# Altium schematic sheet Power.SchDoc
size A4; SheetNumber: 6; SheetTotal: 6
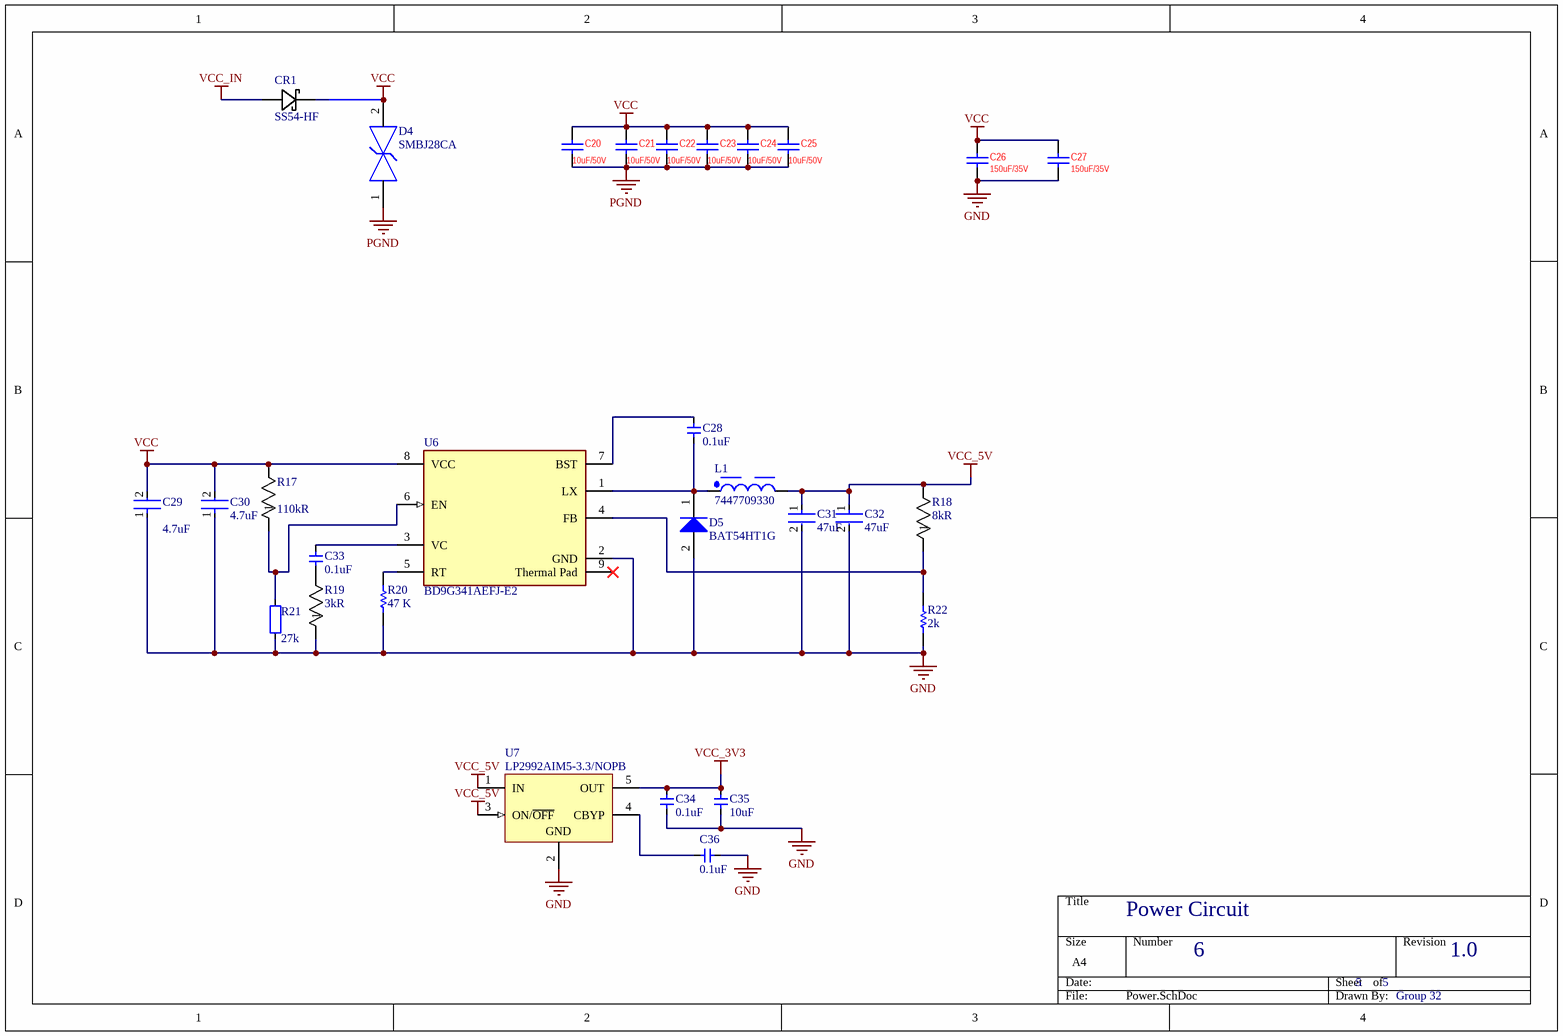
[diagram p0: Power.SchDoc]

## Parts
C20  10uF/50V  [CAPC3216X190N]
C21  10uF/50V  [CAPC3216X190N]
C22  10uF/50V  [CAPC3216X190N]
C23  10uF/50V  [CAPC3216X190N]
C24  10uF/50V  [CAPC3216X190N]
C25  10uF/50V  [CAPC3216X190N]
C26  value 150uF/35V  [CAP_EEEFK1V151AL]  (hidden comment: 220uF/25V)
C27  value 150uF/35V  [CAP_EEEFK1V151AL]  (hidden comment: 220uF/25V)
C28  0.1uF  [CAPC2013X94X50LL20T25]
C29  Capacitance: 4.7uF  [FP-1206-L_3_2_0_2-W_1_6_0-MFG]  (hidden comment: 12061Z475KAT2A)
C30  Capacitance: 4.7uF  [FP-1206-L_3_2_0_2-W_1_6_0-MFG]  (hidden comment: 12061Z475KAT2A)
C31  Capacitance: 47uF  [FP-C3216-160-0_2-IPC_C]  (hidden comment: C3216X6S0J476M160AB)
C32  Capacitance: 47uF  [FP-C3216-160-0_2-IPC_C]  (hidden comment: C3216X6S0J476M160AB)
C33  0.1uF  [CAPC2013X94X50LL20T25]
C34  0.1uF  [CAPC2013X94X50LL20T25]
C35  10uF  [CAPC2013X94X50LL20T25]
C36  0.1uF  [CAPC2013X94X50LL20T25]
CR1  SS54-HF  [SDO_DO-214AC_CIP]
D4  SMBJ28CA  [FP-SMBJ-CA-MFG]
D5  BAT54HT1G  [ONSC-SOD-323-2-477-02_V]
L1  7447709330  [WE-PD_1210]
R17  Resistance: 110kR  [RESC3116X65N]  (hidden comment: TNPW1206110KBEEA (2))
R18  Resistance: 8kR  [RESC3116X65N]  (hidden comment: MCA12060D8001BP500)
R19  Resistance: 3kR  [RESC2013X60X35NL10T20]  (hidden comment: TNPW12063K00BEEA)
R20  Resistance: 47 K  [RESC2013X60X35NL10T20]  (hidden comment: RC0805FR-0747KL)
R21  value 27k  [RESC2013X60X35NL10T20]
R22  R: 2k  [RESC2013X60X35NL10T20]  (hidden comment: RC0805FR-0710KL)
U6  BD9G341AEFJ-E2  [FP-HTSOP-J8-MFG]
U7  LP2992AIM5-3.3/NOPB  [MF05A_L]

## Nets
GND: C26.2 C27.2 C29.1 C30.1 C31.2 C32.2 C34.1 C35.1 C36.1 D5.2(A) R19.1 R20.1 R21.1 R22.1 U6.2(GND) U7.2(GND)
PGND: C20.2 C21.2 C22.2 C23.2 C24.2 C25.2 D4.1
VCC: C20.1 C21.1 C22.1 C23.1 C24.1 C25.1 C26.1 C27.1 C29.2 C30.2 CR1.1(CATHODE) D4.2 R17.2 U6.8(VCC)
VCC_3V3: C34.2 C35.2 U7.5(OUT)
VCC_5V: C31.1 C32.1 L1.2 R18.2 U7.1(IN) U7.3(ON/~{OFF})
VCC_IN: CR1.2(ANODE)
NetC28_1: C28.1 D5.1(K) L1.1 U6.1(LX)
NetC28_2: C28.2 U6.7(BST)
NetC33_1: C33.1 R19.2
NetC33_2: C33.2 U6.3(VC)
NetC36_2: C36.2 U7.4(CBYP)
NetR17_1: R17.1 R21.2 U6.6(EN)
NetR18_1: R18.1 R22.2 U6.4(FB)
NetR20_2: R20.2 U6.5(RT)

Not connected (* = marked no-connect by the designer): U6 9(Thermal_Pad)*

## Notes on the sheet
- Power Circuit
- 6
- 5
- 1.0
- Group 32

## Library data of the parts
C20-C27 = CAP: Capacitor, chip, ceramic; Parameters: E22 CAP; PN: RVT1E221M0607; Price: 0.038
  C20-C25: Value: 10uF/50V
C28 C33-C36 = 电容-0402: Capacitor; Value: 0.1u
C29 C30 = CMP-2000-05019-2: CAP CER 4.7UF 100V X7S 1206; Tolerance: 10%; Thickness: 0.075inch; Max Operating Temperature: 125°C; Termination: SMD/SMT; Dielectric: X7S; Case Code (Metric): 3216; Case/Package: 1206; Height: 0.5mm; Mount: Surface Mount; Voltage Rating (DC): 100V; Min Operating Temperature: -55°C; Package Quantity: 1; Length: 3.2mm; Voltage Rating: 100V; Lead Free: Lead Free; RoHS Compliant: Yes; Packaging: Tape and Reel; Weight: 0.000571oz; REACH SVHC: No SVHC; Case Code (Imperial): 1206; Width: 0.063inch; Depth: 1.6mm
C31 C32 = CMP-08246-006559-1: Multilayer Ceramic Capacitors 47uF ±20% 6.3V X6S SMD 1206; Insulation Resistance: 10GR; Dissipation Factor: 10%; Min Operating Temperature: -55°C; Package Quantity: 1; Case Code (Metric): 3216; Voltage Rating (DC): 6.3V; Thickness: 0.071inch; REACH SVHC: No SVHC; Dielectric Material: Ceramic; RoHS Compliant: Yes; Case/Package: 1206; Packaging: Tape and Reel; Width: 0.063inch; Weight: 0.000571oz; Radiation Hardening: No; Case Code (Imperial): 1206; Max Operating Temperature: 105°C; Depth: 1.6mm; Mount: Surface Mount; Lead Free: Lead Free; Voltage Rating: 6.3V; Termination: SMD/SMT; Tolerance: 20%; Dielectric: X6S; Series: C; Length: 3.2mm; Construction: Flat; Resistor Type: Ceramic; Height: 1.6mm
CR1 = SS54-HF: No Description Available; Mfr_Name: Comchip; Type: Diodes - Rectifiers, Single
D4 = CMP-08607-000057-1: TVS DIODE 28V 45.4V DO214AA; Manufacturer: Littelfuse Inc; Direction: Bidirectional; Peak Pulse Power: 600W; Max Junction Temp: +150°C; Peak Pulse Current: 13.3A; Breakdown Voltage: 31.1V; Number Of Channels: 1; Digikey Description: TVS DIODE 28V 45.4V DO214AA; Temperature Range Low: -65°C; Device Class L1: Circuit Protection; Automotive: No; Device Class L3: unset; Octopart: https://octopart.com/smbj28ca-littelfuse-350757; Temperature Range High: +150°C; Reverse Standoff Voltage: 28V; Mouser Description: In a Pack of 10, Littelfuse SMBJ28CA, Bi-Directional TVS Diode, 600W, 2-Pin DO-214AA; Category: Diode; Device Class L2: TVS Diodes; ComponentLink2URL: https://www.littelfuse.com/~/media/electronics/datasheets/tvs_diodes/littelfuse_tvs_diode_smbj_datasheet.pdf.pdf; Clamping Voltage: 45.4V; Manufacturer Part Number: SMBJ28CA; RoHS: TRUE; Height: 2.61mm; Package: SMBJ-CA; ComponentLink2Description: Datasheet; Lead Free: Yes; Temperature: -65°C to +150°C
D5 = CMP-1055-00462-1: Schottky Barrier Diode, 2-Pin SOD-323, Pb-Free, Tape and Reel; Manufacturer: On Semiconductor; Configuration: Single; trr Max (ns): 5; IFSM Max (A): 0.6; ComponentLink3URL: http://www.onsemi.com/pub_link/Collateral/477-02.PDF.1; PackageDescription: 2-Pin SOD, Body 1.7 x 1.25 mm; ComponentLink2URL: http://www.onsemi.cn/pub_link/Collateral/BAT54HT1-D.PDF; ComponentLink3Description: Package Specification; ComponentLink2Description: Datasheet; DatasheetVersion: Rev. 6; PackageReference: SOD-323-2-477-02; RoHS: TRUE; ComponentLink1URL: http://www.onsemi.com/; Packing: Tape and Reel; PartNumber: BAT54HT1G; Mounting Technology: Surface Mount; ComponentLink1Description: Manufacturer URL; PackageVersion: Rev. H, 03/2007
L1 = CMP-0227-00179-2: NexarPartId: 22866921; DC Resistance (DCR): 37mΩ; Inductance Tolerance: 20%; Self Resonant Frequency: 8.5MHz; Current Rating: 4.2A; Inductance: 33µH; Height: 10mm; Ambient Temperature Range High: 85°C; Number of Pins: 2; Width: 12mm; Min Operating Temperature: -40°C; Resistance: 37mΩ; Max Operating Temperature: 125°C; Ambient Temperature Range Low: -40°C; Packaging: Cut Tape (CT); RoHS: Compliant; Length: 12mm
R17 = TNPW1206110KBEEA (2): Fixed Resistor, Thin Film, 0.25W, 110000ohm, 200V, 0.1% +/-Tol, 25ppm/Cel, Surface Mount, 1206; Manufacturer: Vishay Dale; Rated Power Dissipation (P): 250mW; Rated Temperature: 70°C; Temperature Coefficient: 25ppm/°C; Package Height: 0.55mm; Package Length: 3.2mm; Package Width: 1.6mm; Reference Standard: AEC-Q200; Supplier 1: Mouser; Manufacturer Part Number: TNPW1206110KBEEA; RoHS: Yes; Category: Chip SMD Resistors; Stock 1: 19950; Pricing 1: 1=0.64, 10=0.458, 50=0.351, 100=0.311, 1000=0.202, 10000=0.191 (USD); Mount: Surface Mount; Number of Pins: 2; Size Code: 1206; Terminal Finish: Nickel; Min Operating Temperature: -55°C; Max Operating Temperature: 125°C; Tolerance: 0.1%; Resistor Type: FIXED RESISTOR; Construction: Chip; Package Style: SMTMeter; Packaging: Tape and Reel; Technology: THIN FILM; Termination: Wraparound; Working Voltage: 200V; Reach SVHC Compliant: Yes; RoHS Compliant: Yes; ComponentLink1URL: https://datasheet.ciiva.com:443/pdfs/VipMasterIC/IC/VISH/VISH-S-A0002290253/VISH-S-A0002290253-1.pdf?src-supplier=IHS+Markit; ComponentLink1Description: https://datasheet.ciiva.com:443/pdfs/VipMasterIC/IC/VISH/VISH-S-A0002290253/VISH-S-A0002290253-1.pdf?src-supplier=IHS+Markit; ComponentLink2URL: https://datasheet.ciiva.com/2607/tnpw-e3-2607341.pdf?src-supplier=Digikey; ComponentLink2Description: https://datasheet.ciiva.com/2607/tnpw-e3-2607341.pdf?src-supplier=Digikey; ComponentLink3URL: https://datasheet.ciiva.com/8978/tnpw-e3-8978104.pdf?src-supplier=Avnet; ComponentLink3Description: https://datasheet.ciiva.com/8978/tnpw-e3-8978104.pdf?src-supplier=Avnet
R18 = MCA12060D8001BP500: Fixed Resistor, Thin Film, 0.25W, 8000ohm, 200V, 0.1% +/-Tol, 25ppm/Cel, Surface Mount, 1206; Manufacturer: Vishay BCcomponents; Rated Power Dissipation (P): 250mW; Rated Temperature: 70°C; Temperature Coefficient: 25ppm/°C; Supplier 1: Digikey; Manufacturer Part Number: MCA12060D8001BP500; RoHS: Yes; Category: Chip SMD Resistors; Pricing 1: 5000=0.16835 (USD); Mount: Surface Mount; Number of Pins: 2; Package Shape: Rectangular; Size Code: 1206; Terminal Finish: Nickel; Min Operating Temperature: -55°C; Max Operating Temperature: 125°C; Tolerance: 0.1%; JESD-609 Code: e3; Resistor Type: FIXED RESISTOR; Packaging: Tape and Reel; Technology: THIN FILM; Termination: Wraparound; Working Voltage: 200V; Reach SVHC Compliant: Yes; RoHS Compliant: Yes; ComponentLink1URL: https://datasheet.ciiva.com:443/pdfs/VipMasterIC/IC/VISH/VISH-S-A0002473671/VISH-S-A0002473671-1.pdf?src-supplier=IHS+Markit; ComponentLink1Description: https://datasheet.ciiva.com:443/pdfs/VipMasterIC/IC/VISH/VISH-S-A0002473671/VISH-S-A0002473671-1.pdf?src-supplier=IHS+Markit; ComponentLink2URL: https://datasheet.ciiva.com/2606/mc-pre-2606068.pdf?src-supplier=Digikey; ComponentLink2Description: https://datasheet.ciiva.com/2606/mc-pre-2606068.pdf?src-supplier=Digikey
R19 = TNPW12063K00BEEA: Fixed Resistor, Thin Film, 0.25W, 3000ohm, 200V, 0.1% +/-Tol, 25ppm/Cel, Surface Mount, 1206; Manufacturer: Vishay Dale; Rated Power Dissipation (P): 250mW; Rated Temperature: 70°C; Temperature Coefficient: 25ppm/°C; Package Height: 0.55mm; Package Length: 3.2mm; Package Width: 1.6mm; Reference Standard: AEC-Q200; Supplier 1: Mouser; Manufacturer Part Number: TNPW12063K00BEEA; RoHS: Yes; Category: Chip SMD Resistors; Stock 1: 8904; Pricing 1: 1=0.64, 10=0.458, 50=0.351, 100=0.311, 1000=0.202, 10000=0.186 (USD); Mount: Surface Mount; Number of Pins: 2; Size Code: 1206; Terminal Finish: Nickel; Min Operating Temperature: -55°C; Max Operating Temperature: 125°C; Tolerance: 0.1%; Resistor Type: FIXED RESISTOR; Construction: Chip; Package Style: SMTMeter; Packaging: Tape and Reel; Technology: THIN FILM; Termination: Wraparound; Working Voltage: 200V; Reach SVHC Compliant: Yes; RoHS Compliant: Yes; ComponentLink1URL: https://datasheet.ciiva.com:443/pdfs/VipMasterIC/IC/VISH/VISH-S-A0002290253/VISH-S-A0002290253-1.pdf?src-supplier=IHS+Markit; ComponentLink1Description: https://datasheet.ciiva.com:443/pdfs/VipMasterIC/IC/VISH/VISH-S-A0002290253/VISH-S-A0002290253-1.pdf?src-supplier=IHS+Markit; ComponentLink2URL: http://www.mouser.com/ds/2/427/tnpw_e3-64594.pdf?src-supplier=Mouser; ComponentLink2Description: http://www.mouser.com/ds/2/427/tnpw_e3-64594.pdf?src-supplier=Mouser; ComponentLink3URL: http://www.vishay.com/docs/28758/tnpw_e3.pdf?src-supplier=Avnet; ComponentLink3Description: http://www.vishay.com/docs/28758/tnpw_e3.pdf?src-supplier=Avnet; ComponentLink4URL: http://www.vishay.com/docs/28758/tnpw_e3.pdf?src-supplier=Digikey; ComponentLink4Description: http://www.vishay.com/docs/28758/tnpw_e3.pdf?src-supplier=Digikey
R20 = CMP-1659-00011-4: Chip Resistor, 47 KOhm, +/- 1%, 0.125 W, -55 to 155 degC, 0805 (2012 Metric), RoHS, Tape and Reel; Manufacturer: Yageo; Voltage Rating: 150 V; Height: 0.5 mm; ComponentLink2URL: http://www.yageo.com/documents/recent/PYu-RC_Group_51_RoHS_L_04.pdf; ComponentLink2Description: Datasheet; Package Quantity: 200; Max Operating Temperature: 155 degC; Min Operating Temperature: -55 degC; Packaging: Tape and Reel; Pins: 2; PackageReference: 0805; Mounting Technology: Surface Mount; ComponentLink1Description: Manufacturer URL; ComponentLink1URL: http://www.yageo.com/; PackageDescription: 2-Pin Surface Mounted Device, Body 2 x 1.25 mm; Length: 2 mm; REACH SVHC: No SVHC; Mount: Surface Mount; RoHSCompliant: true; DatasheetVersion: Rev. 4, 02/2016
R21 = 电阻-1206: Resistor
R22 = CMP-1659-00013-4: Chip Resistor, 10 KOhm, +/- 1%, 0.125 W, -55 to 155 degC, 0805 (2012 Metric), RoHS, Tape and Reel; Manufacturer: Yageo; Voltage Rating: 150 V; REs: 10k; Mount: Surface Mount; ComponentLink1Description: Manufacturer URL; ComponentLink2URL: http://www.yageo.com/documents/recent/PYu-RC_Group_51_RoHS_L_04.pdf; Pins: 2; Length: 2 mm; Min Operating Temperature: -55 degC; Height: 0.5 mm; Mounting Technology: Surface Mount; RoHSCompliant: true; REACH SVHC: No SVHC; ComponentLink1URL: http://www.yageo.com/; Max Operating Temperature: 155 degC; PackageReference: 0805; DatasheetVersion: Rev. 4, 02/2016; Package Quantity: 5000; Packaging: Tape and Reel; ComponentLink2Description: Datasheet; PackageDescription: 2-Pin Surface Mounted Device, Body 2 x 1.25 mm
U6 = CMP-08938-000001-1: IC REG BUCK ADJ 3A 8HTSOP-J; Manufacturer: Rohm; Output Type: Fixed; Number Of Outputs: 1; Max Power Dissipation: 3.76W; Min Supply Voltage: 12V; Standoff Height: 0mm; Output Voltage: 1V; Max Supply Voltage: 76V; Switching Frequency: 50-750kHz; Max Junction Temp: +150°C; Nominal Supply Current: 1.5mA; Temperature Range High: +85°C; Height: 1mm; Temperature: -40°C to +85°C; Octopart: https://octopart.com/bd9g341aefj-e2-rohm-61817816; Device Class L1: Integrated Circuits (ICs); ComponentLink2Description: Datasheet; Manufacturer Part Number: BD9G341AEFJ-E2; RoHS: TRUE; Footprint Url: https://d1d2qsbl8m0m72.cloudfront.net/en/techdata_basic/ic/package/htsop-j8_1-e.pdf; Temperature Range Low: -40°C; Device Class L2: Power Management ICs; Switching Topology: Buck; Output Current: 3A; Device Class L3: Voltage Regulators - Switching; Package: HTSOP-J8; ComponentLink2URL: https://www.rohm.com/datasheet/BD9G341AEFJ/bd9g341aefj-e; Automotive: No; Ipc Land Pattern Name: SOIC127P600X100-8; Digikey Description: IC REG BUCK ADJ 3A 8HTSOP-J; Category: IC; Lead Free: Yes
U7 = CMP-0062-02136-2: Micropower 250 mA Low-Noise Ultra Low-Dropout Regulator, 5-pin SOT-23, Pb-Free; Manufacturer: National Semiconductor; PowerWise: N; PackageTopMarking: LFEA*XTT; CompType: LDO IC; ComponentLink2Description: LP2992 Web Page; ComponentLink3Description: MF05A Package Page; PackageVersion: revD, Aug-2008; RoHS: Y; ComponentLink1Description: LP2992 Datasheet; DatasheetVersion: May-2005; PackageReference: MF05A; PackageDescription: Molded SOT-23, .115 x .063 x .040 in Body, 5 Lead, .0375 in Pitch; ComponentLink1URL: http://www.national.com/ds/LP/LP2992.pdf; ComponentLink3URL: http://www.national.com/packaging/folders/mf05a.html; RevisionNote: Component URLs added; PinCount: 5; ComponentLink2URL: http://www.national.com/pf/LP/LP2992.html